# Altium schematic sheet [04] GPS.SchDoc
size A4; SheetNumber: 4; SheetTotal: 6
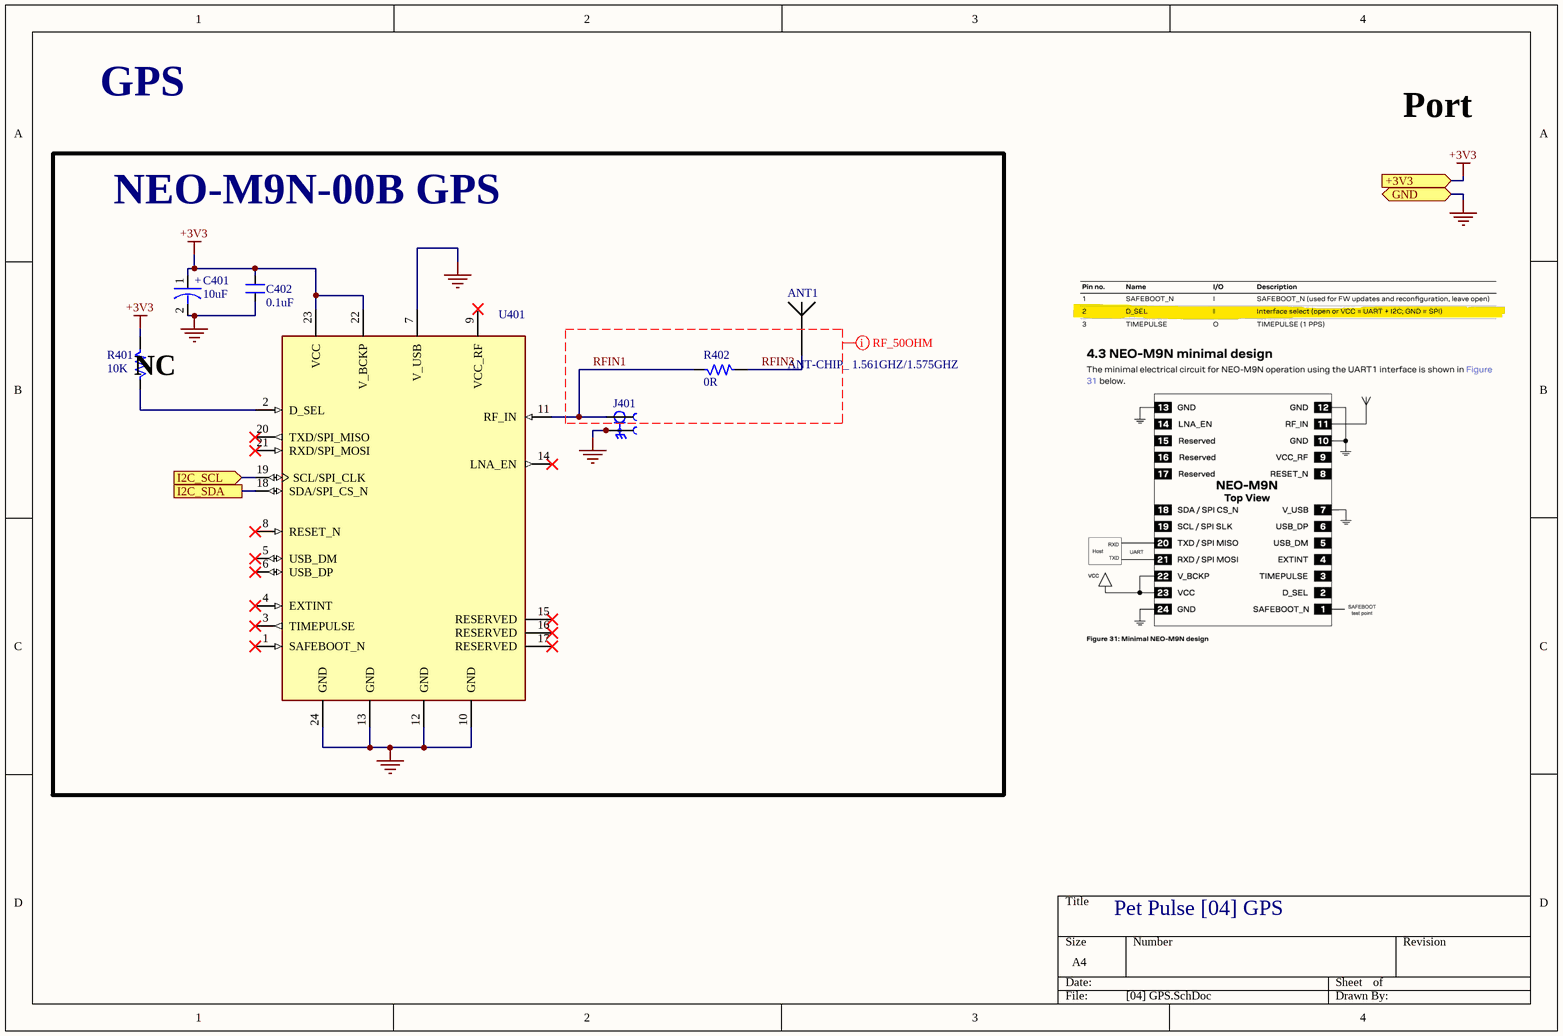
[diagram p0: [04] GPS.SchDoc]

## Parts
ANT1  ANT-CHIP_ 1.561GHZ/1.575GHZ  [ANT_1575AT43A0040001E]
C401  10uF  [CAP-T_1206]
C402  0.1uF  [CAP_0805]
J401  CON_UFL-SMD-T  [CON-UFL-SMD-T]  (value not drawn)
R401  10K  [RES_0805]
R402  0R  [RES_0603]
U401  IC_GPS/GNSS_NEO-M9N-00B  [IC_NEO-M9N-00B]  (value not drawn)

## Ports
+3V3 (in, see [02] LDO and LiPo Circuit[4A], [03] ESP32[2C], [05] External Modules[4A], [06] LTE - A7670C[8A]), GND (bidir, see [02] LDO and LiPo Circuit[4A], [03] ESP32[2C], [05] External Modules[4A], [06] LTE - A7670C[8A]), I2C_SCL (in, see [03] ESP32[4B], [05] External Modules[3B]), I2C_SDA (see [03] ESP32[4B], [05] External Modules[3B])

## Nets
+3V3: C401.1 C402.2 R401.2 U401.22(V_BCKP) U401.23(VCC) ; port +3V3
GND: C401.2 C402.1 J401.2 J401.3 U401.7(V_USB) U401.10(GND) U401.12(GND) U401.13(GND) U401.24(GND) ; port GND
I2C_SCL: U401.19(SCL/SPI_CLK) ; port I2C_SCL
I2C_SDA: U401.18(SDA/SPI_CS_N) ; port I2C_SDA
RFIN1: J401.1 R402.1 U401.11(RF_IN)
RFIN2: ANT1.1 R402.2
NetR401_1: R401.1 U401.2(D_SEL)

Not connected (* = marked no-connect by the designer): U401 1(SAFEBOOT_N)* 3(TIMEPULSE)* 4(EXTINT)* 5(USB_DM)* 6(USB_DP)* 8(RESET_N)* 9(VCC_RF)* 14(LNA_EN)* 15(RESERVED)* 16(RESERVED)* 17(RESERVED)* 20(TXD/SPI_MISO)* 21(RXD/SPI_MOSI)*

## Layout directives
net class RF_50: RFIN1, RFIN2

## Notes on the sheet
- GPS
- Port
- NEO-M9N-00B GPS
- (near R401) NC
- Pet Pulse [04] GPS
- (in symbol CAP-P_10uF-16V-10%-1206) +

## Library data of the parts
ANT1 = ANT-CHIP_ 1.561GHZ/1.575GHZ: Manufacturer: Johanson Technology Inc.; Manufacturer Part Number: 1575AT43A0040E; Case/Package: SMD
C401 = CAP-P_10uF-16V-10%-1206: 10µF Molded Tantalum Capacitors 16V 1206 (3216 Metric) 3Ohm; Manufacturer: AVX Corporation; Manufacturer Part Number: TAJA106K016SNJ; Alternate Part Number-1: CA45-A016K106T; Case/Package: 1206; Supplier-1: SIRICOM; Supplier Part Number-1: TAJA106K016SNJ
C402 = CAP_0.1uF-50V-10%-0805: 0.1µF ±10% 50V Ceramic Capacitor X7R 0805 (2012 Metric); Manufacturer: Samsung; Manufacturer Part Number: CL21B104KBCNNNC; Alternate Part Number-1: NA; Case/Package: 0805; Supplier-1: SIRICOM; Supplier Part Number-1: 0805B104K500CT
J401 = CON_UFL-SMD-T: U.FL (UMCC) Connector Jack, Male Pin 50Ohm Surface Mount Solder; MP: CONUFL001-SMD-T; MF: Linx; Price: None; Package: None; Value: *; Check_prices: https://www.snapeda.com/parts/CONUFL001-SMD-T/Linx/view-part/?ref=eda; Availability: Unavailable; SnapEDA_Link: https://www.snapeda.com/parts/CONUFL001-SMD-T/Linx/view-part/?ref=snap
R401 = RES_10K-0.125W-1%-0805: 10 kOhms ±1% 0.125W, 1/8W Chip Resistor 0805 (2012 Metric) Automotive AEC-Q200 Thick Film; Manufacturer: CTS; Manufacturer Part Number: WR08X1002FTL; Case/Package: 0805; Supplier-1: SIRICOM; Supplier Part Number-1: WR08X1002FTL; Alternate Part Number-1: WR08X1002FTL
R402 = RES_0R-0.1W-0603: 0 Ohms 0603 (1608 Metric); Manufacturer: Stackpole Electronics Inc; Manufacturer Part Number: RMCF0603ZT0R00; Alternate Part Number-1: NA; Case/Package: 0603; Supplier-1: Digi-Key; Supplier Part Number-1: RMCF0603ZT0R00CT-ND
U401 = IC_GPS/GNSS_NEO-M9N-00B: M9 RF Receiver BeiDou, Galileo, GLONASS, GNSS, GPS -167dBm Module; Manufacturer: u-blox; Manufacturer Part Number: NEO-M9N-00B; Case/Package: SMD